# EAGLE design ESP_IAQ_baseBoard (EAGLE 9.6.2)
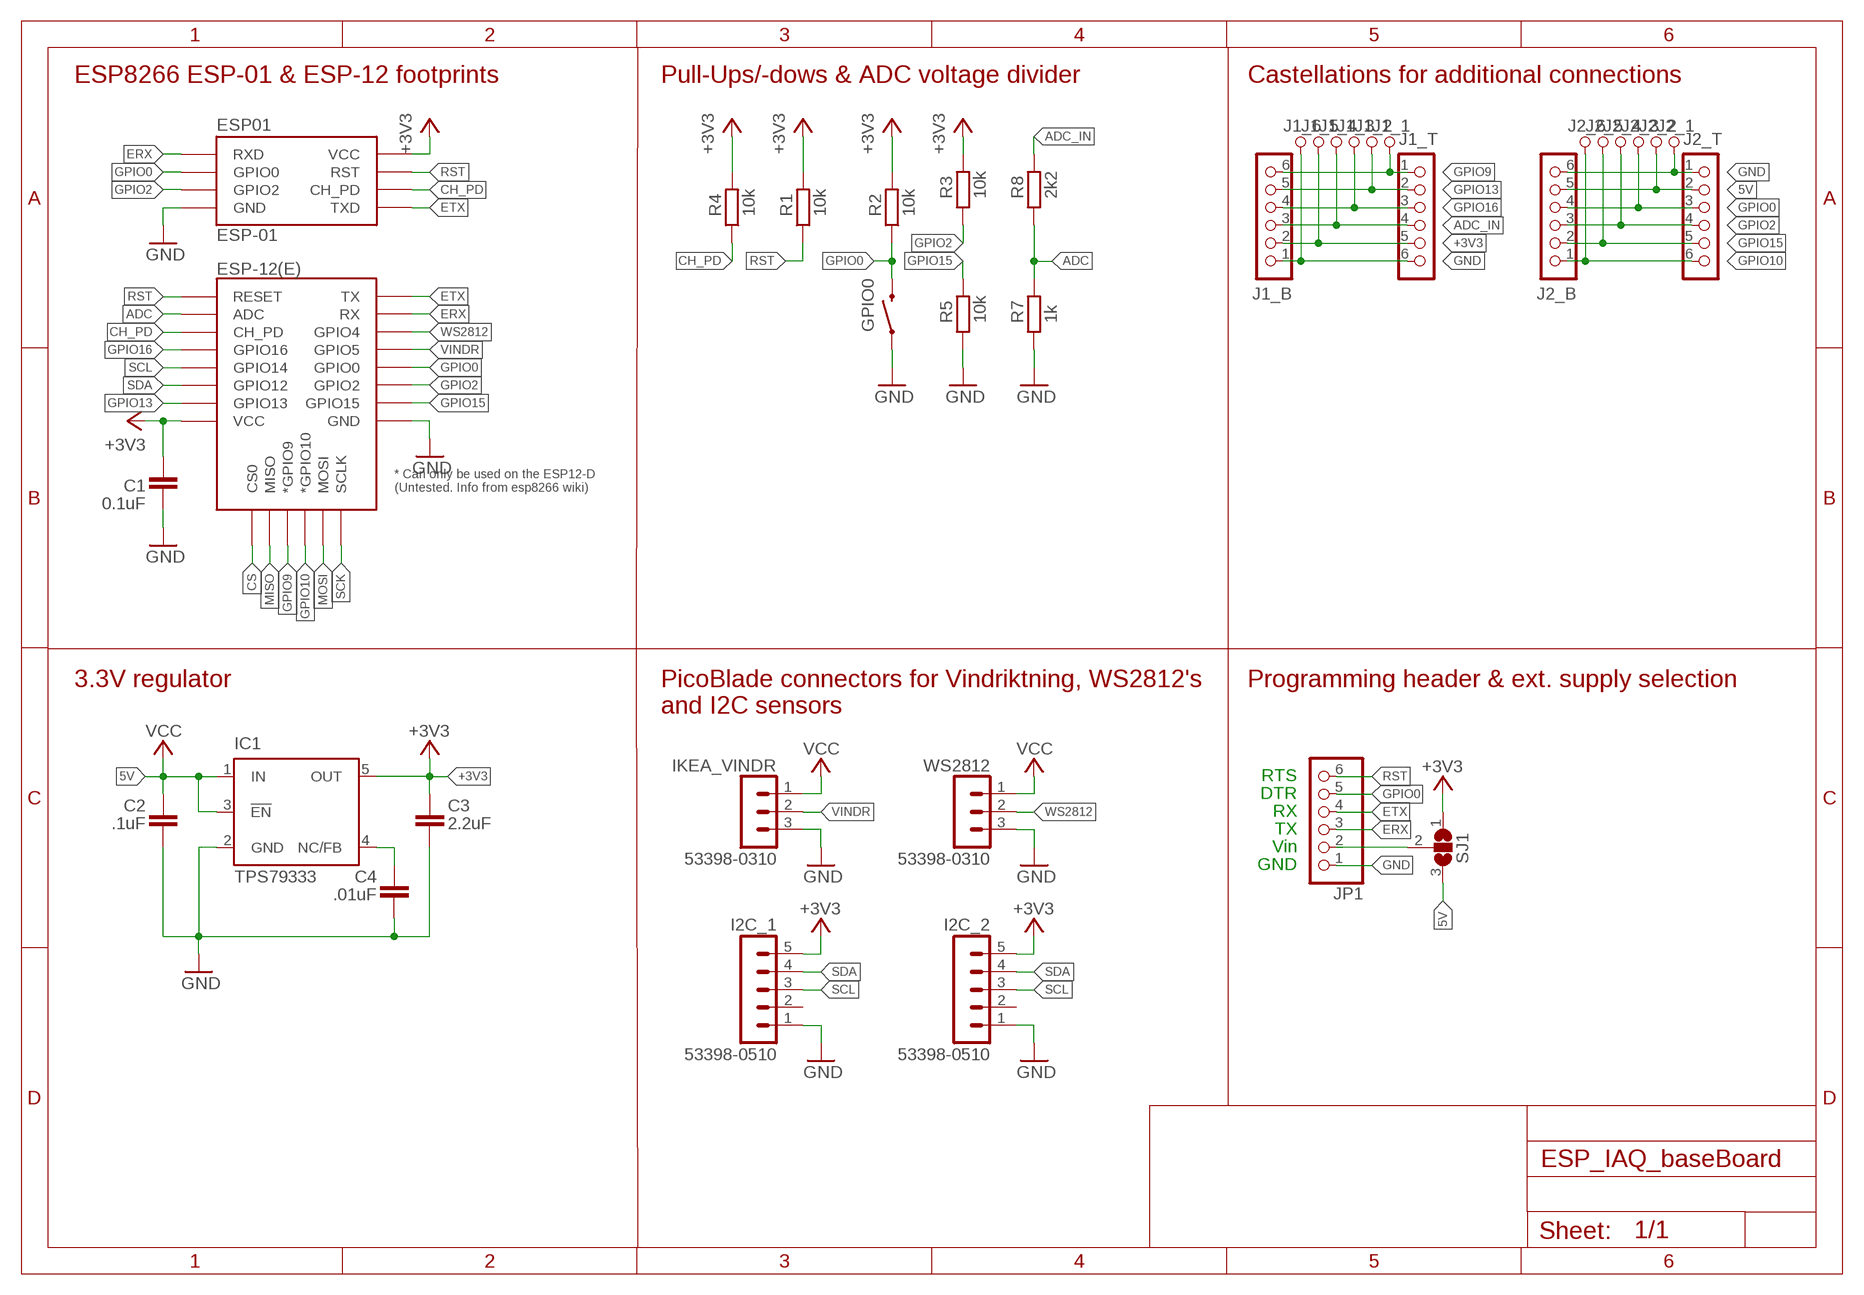
[diagram p0: schematic, sheet 1]

## Parts
C1  0.1uF  CAPACITOR_NPOL-0805  [C805]
C2  .1uF  CAPACITOR_NPOL-0805  [C805]
C3  2.2uF  CAPACITOR_NPOL-0805  [C805]
C4  .01uF  CAPACITOR_NPOL-0805  [C805]
ESP-01  ESP01  [ESP01]
ESP-12(E)  ESP12ESMD  [ESP12E-SMD]
GPIO0  MOMENTARY-SWITCH-SPST-SMD-RIGHT-ANGLE  [TACTILE_SWITCH_SMD_RIGHT_ANGLE]
I2C_1  53398-0510  [53398-0510]
I2C_2  53398-0510  [53398-0510]
IC1  TPS79333  TPS77033  [SOT23-DBV]
IKEA_VINDR  53398-0310  [53398-0310]
J1_1  PAD_TERMINAL-1.02MM_ROUND  [CON_PAD_ROUND_1.02MM]
J1_2  PAD_TERMINAL-1.02MM_ROUND  [CON_PAD_ROUND_1.02MM]
J1_3  PAD_TERMINAL-1.02MM_ROUND  [CON_PAD_ROUND_1.02MM]
J1_4  PAD_TERMINAL-1.02MM_ROUND  [CON_PAD_ROUND_1.02MM]
J1_5  PAD_TERMINAL-1.02MM_ROUND  [CON_PAD_ROUND_1.02MM]
J1_6  PAD_TERMINAL-1.02MM_ROUND  [CON_PAD_ROUND_1.02MM]
J1_B  CON_HEADER_1X06-SMD-RIGHT-ANGLED  [M1X6_MALE_RIGHT_ANGLED_SMD]
J1_T  CON_HEADER_1X06-SMD-RIGHT-ANGLED  [M1X6_MALE_RIGHT_ANGLED_SMD]
J2_1  PAD_TERMINAL-1.02MM_ROUND  [CON_PAD_ROUND_1.02MM]
J2_2  PAD_TERMINAL-1.02MM_ROUND  [CON_PAD_ROUND_1.02MM]
J2_3  PAD_TERMINAL-1.02MM_ROUND  [CON_PAD_ROUND_1.02MM]
J2_4  PAD_TERMINAL-1.02MM_ROUND  [CON_PAD_ROUND_1.02MM]
J2_5  PAD_TERMINAL-1.02MM_ROUND  [CON_PAD_ROUND_1.02MM]
J2_6  PAD_TERMINAL-1.02MM_ROUND  [CON_PAD_ROUND_1.02MM]
J2_B  CON_HEADER_1X06-SMD-RIGHT-ANGLED  [M1X6_MALE_RIGHT_ANGLED_SMD]
J2_T  CON_HEADER_1X06-SMD-RIGHT-ANGLED  [M1X6_MALE_RIGHT_ANGLED_SMD]
JP1  PINHD-1X6LOCK  [1X06-BIGLOCK]
R1  10k  RESISTOR-0603  [R603]
R2  10k  RESISTOR-0603  [R603]
R3  10k  RESISTOR-0603  [R603]
R4  10k  RESISTOR-0603  [R603]
R5  10k  RESISTOR-0603  [R603]
R7  1k  RESISTOR-0603  [R603]
R8  2k2  RESISTOR-0603  [R603]
SJ1  SJ2W  [SJ_2]
WS2812  53398-0310  [53398-0310]

## Nets
5V: C2.1 IC1.1(IN) IC1.3(!EN) IKEA_VINDR.1 J2_2.P J2_B.5 J2_T.2 SJ1.3 WS2812.1 ; supply symbol labelled VCC
+3V3: C1.1 C3.1 ESP-01.VCC ESP-12(E).VCC I2C_1.5 I2C_2.5 IC1.5(OUT) J1_5.P J1_B.2 J1_T.5 R1.2 R2.2 R3.2 R4.2 SJ1.1
ADC: ESP-12(E).ADC R7.2 R8.1
ADC_IN: J1_4.P J1_B.3 J1_T.4 R8.2
BYPASS: C4.1 IC1.4(NC/FB)
CH_PD: ESP-01.CH_PD ESP-12(E).CH_PD R4.1
CS: ESP-12(E).CS0
ERX: ESP-01.RX(RXD) ESP-12(E).RXD0(RX) JP1.3
ETX: ESP-01.TX(TXD) ESP-12(E).TXD0(TX) JP1.4
GND: C1.2 C2.2 C3.2 C4.2 ESP-01.GND ESP-12(E).GND GPIO0.1 I2C_1.1 I2C_2.1 IC1.2(GND) IKEA_VINDR.3 J1_6.P J1_B.1 J1_T.6 J2_1.P J2_B.6 J2_T.1 JP1.1 R5.1 R7.1 WS2812.3
GPIO0: ESP-01.GPIO0 ESP-12(E).GPIO0 GPIO0.2 J2_3.P J2_B.4 J2_T.3 JP1.5 R2.1
GPIO2: ESP-01.GPIO2 ESP-12(E).GPIO2 J2_4.P J2_B.3 J2_T.4 R3.1
GPIO9: ESP-12(E).GPIO9(*GPIO9) J1_1.P J1_B.6 J1_T.1
GPIO10: ESP-12(E).GPIO10(*GPIO10) J2_6.P J2_B.1 J2_T.6
GPIO13: ESP-12(E).GPIO13 J1_2.P J1_B.5 J1_T.2
GPIO15: ESP-12(E).GPIO15 J2_5.P J2_B.2 J2_T.5 R5.2
GPIO16: ESP-12(E).GPIO16 J1_3.P J1_B.4 J1_T.3
MISO: ESP-12(E).MISO
MOSI: ESP-12(E).MOSI
RST: ESP-01.RST ESP-12(E).RESET JP1.6 R1.1
SCK: ESP-12(E).SCLK
SCL: ESP-12(E).GPIO14 I2C_1.3 I2C_2.3
SDA: ESP-12(E).GPIO12 I2C_1.4 I2C_2.4
VIN: JP1.2 SJ1.2
VINDR: ESP-12(E).GPIO5 IKEA_VINDR.2
WS2812: ESP-12(E).GPIO4 WS2812.2
Unconnected: I2C_1.2 I2C_2.2

## Notes on the sheet
- ESP8266 ESP-01 & ESP-12 footprints | Pull-Ups/-dows & ADC voltage divider | Castellations for additional connections
- 3.3V regulator
- PicoBlade connectors for Vindriktning, WS2812's
  and I2C sensors
- Programming header & ext. supply selection
- RTS
- DTR
- RX
- TX
- Vin
- GND

## Library data of the parts
C1-C4 = dp_devices:CAPACITOR_NPOL: Non-Polarized capacitor in various packages
ESP-01 = esp8266modules:ESP01: ESP8266 Wifi module 01
ESP-12(E) = esp8266modules:ESP12E: ESP12E Module
GPIO0 = SparkFun-Switches:MOMENTARY-SWITCH-SPST: Momentary Switch (Pushbutton) - SPST Normally-open (NO) SPST momentary switches (buttons, pushbuttons). Variants PTH-12MM - 12mm square, through-hole Momentary Pushbutton Switch - 12mm Square <https://www.sparkfun.com/products/9190> (COM-09190) PTH-6.0MM, PTH-6.0MM-KIT - 6.0mm square, through-hole Mini Pushbutton Switch <https://www.sparkfun.com/products/97> (COM-00097) KIT package intended for soldering kit's - only one side of pads' copper is exposed. PTH-RIGHT-ANGLE-KIT - Right-angle, through-hole Right Angle Tactile Button <https://www.sparkfun.com/products/10791> - Used on SparkFun BigTime Watch Kit <https://www.sparkfun.com/products/11734> SMD-12MM - 12mm square, surface-mount Tactile Button - SMD (12mm) <https://www.sparkfun.com/products/12993> (COM-12993) Used on SparkFun PicoBoard <https://www.sparkfun.com/products/11888> SMD-4.5MM - 4.5mm Square Trackball Switch Used on SparkFun Blackberry Trackballer Breakout <https://www.sparkfun.com/products/13169> SMD-4.6MMX2.8MM - 4.60mm x 2.80mm, surface mount Used on SparkFun SAMD21 Mini Breakout <https://www.sparkfun.com/products/13664> SMD-5.2MM, SMD-5.2-REDUNDANT - 5.2mm square, surface-mount Mini Pushbutton Switch - SMD <https://www.sparkfun.com/products/8720> (COM-08720) Used on Arduino Pro Mini <https://www.sparkfun.com/products/11114> REDUNDANT package connects both switch circuits together SMD-6.0X3.5MM - 6.0 x 3.5mm, surface mount Momentary Reset Switch SMD <https://www.sparkfun.com/products/8229> (COM-08229) SMD-6.2MM-TALL - 6.2mm square, surface mount Tactile Button - SMD (6mm) <https://www.sparkfun.com/products/12992> Used on SparkFun Digital Sandbox <https://www.sparkfun.com/products/12651> SMD-RIGHT-ANGLE - Right-angle, surface mount Used on SparkFun Block for Intel® Edison - Arduino <https://www.sparkfun.com/products/13036>; PROD_ID: COMP-12265
I2C_1 I2C_2 = con-molex-picoblade:53398-0510: HEADER
IC1 = texas:TPS770*: ULTRALOW-POWER 50-mA LOW-DROPOUT LINEAR REGULATORS 50-mA Low-Dropout Regulator Source: http://focus.ti.com/lit/ds/symlink/tps77001.pdf; MF: TEXAS INSTRUMENTS; MPN: TPS77033DBVT; OC_FARNELL: 8461570; OC_NEWARK: 77C1187
IKEA_VINDR WS2812 = con-molex-picoblade:53398-0310: HEADER
J1_1-J1_6 J2_1-J2_6 = dp_devices:PAD_TERMINAL: Terminal connection pad
J1_B J1_T J2_B J2_T = dp_devices:CON_HEADER_1X06
JP1 = adafruit:PINHD-1X6: PIN HEADER
R1-R5 R7 R8 = dp_devices:RESISTOR
SJ1 = jumper:SJ2W: SMD solder JUMPER

## Board
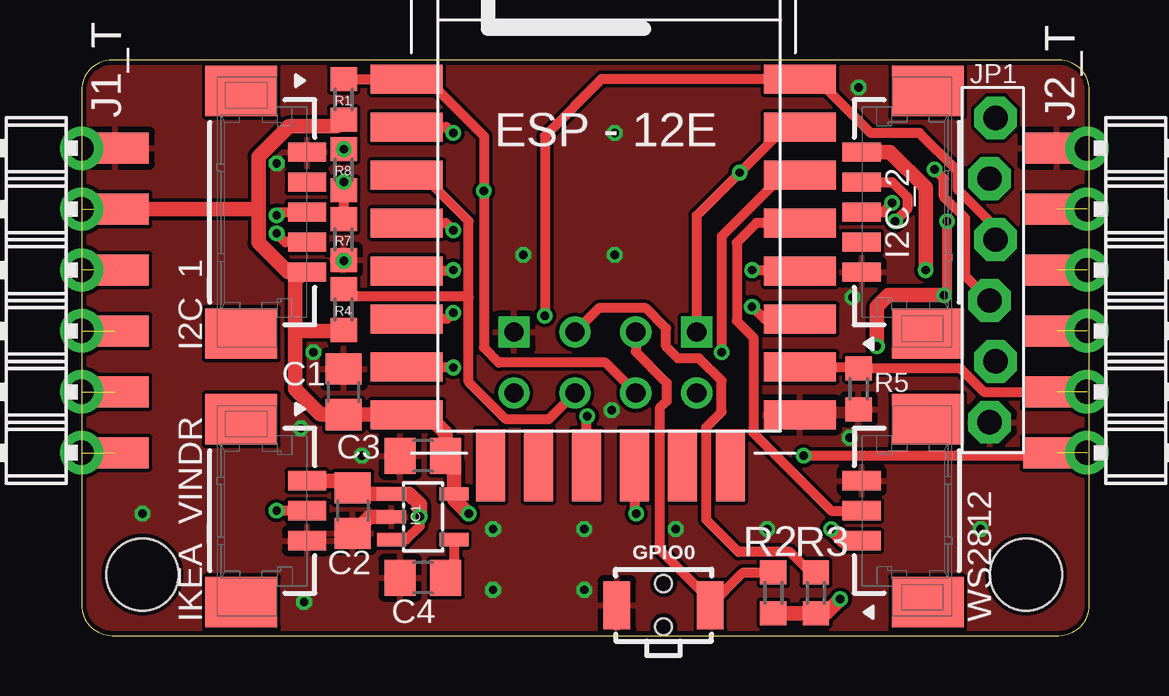
[diagram p1: board, top side]
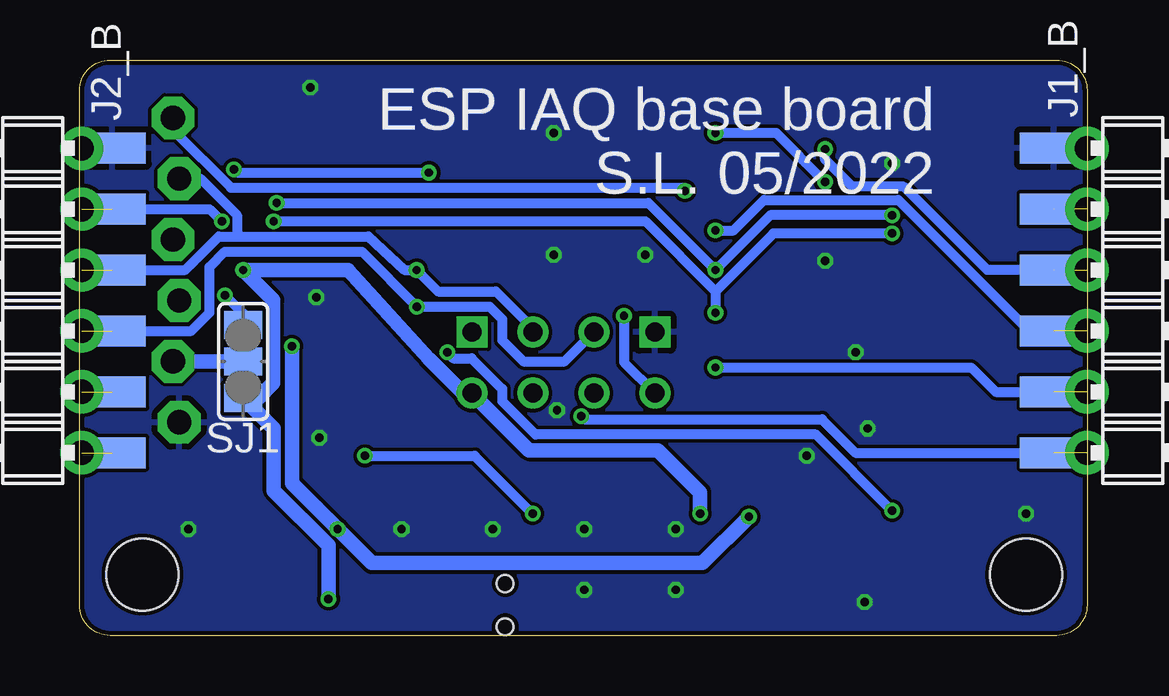
[diagram p2: board, bottom side, seen from below]

Size 42 x 24 mm. Coordinates in mm from the lower left corner, seen from the top.
Outline: 0,22.73 0,1.27 arc90 1.27,0 40.73,0 arc90 42,1.27 42,22.73 arc90 40.73,24 1.27,24 arc90 0,22.73
Copper layers (1*16): Top 0.035mm / dielectric 1.5mm / Bottom 0.035mm
Design rules "aisler_2_layer": minimum track width 0.1mm, minimum drill 0.2mm, track to track 0.15mm, track to pad 0.15mm, pad to pad 0.1mm, via to via 0.1mm, smd to smd 0.1mm, copper to edge 0.2mm, drill to drill 0.21mm, minimum pad ring 0.25mm, minimum via ring 0.15mm, stop-mask expansion 0mil, vias tented up to drill 0mil, thermal gap 10mil
Holes 3 mm at 2.54,2.54 39.37,2.54

### Footprints (pad centres in the part's own frame; a part is rotated, then mirrored left to right if it is on the bottom)
C805 = smd 1.3 x 1.5: 1 -0.95,0; 2 0.95,0
ESP01 = drill 0.8: CH_PD -1.285,-8.178; GPIO0 1.255,-5.638; GPIO2 -1.285,-5.638; RST 1.255,-8.178; TX -3.825,-8.178; VCC 3.795,-8.178 | drill 0.8 square: GND -3.825,-5.638; RX 3.795,-5.638
ESP12E-SMD = smd 3 x 1.2: ADC -8.3,3.8; CH_PD -8.3,1.8; GND 8.1,-8.2; GPIO0 8.1,-2.2; GPIO2 8.1,-4.2; GPIO4 8.1,-0.2; GPIO5 8.1,1.8; GPIO12 -8.3,-4.2; GPIO13 -8.3,-6.2; GPIO14 -8.3,-2.2; GPIO15 8.1,-6.2; GPIO16 -8.3,-0.2; RESET -8.3,5.8; RXD0 8.1,3.8; TXD0 8.1,5.8; VCC -8.3,-8.2 | smd 1.2 x 3: CS0 -4.8,-10.3; GPIO9 -0.8,-10.3; GPIO10 1.2,-10.3; MISO -2.8,-10.3; MOSI 3.2,-10.3; SCLK 5.2,-10.3
TACTILE_SWITCH_SMD_RIGHT_ANGLE = smd 1.1 x 2: 1 -1.95,0; 2 1.95,0 | hole 0.7: 0,0.9; 0,-0.9
53398-0510 = smd 0.8 x 1.6: 1 2.5,0; 2 1.25,0; 3 0,0; 4 -1.25,0; 5 -2.5,0 | smd 2.1 x 3: M1 5.06,2.75; M2 -5.06,2.75
SOT23-DBV = smd 0.55 x 1.2: 1 -0.95,-1.3; 2 0,-1.3; 3 0.95,-1.3; 4 0.95,1.3; 5 -0.95,1.3
53398-0310 = smd 0.8 x 1.6: 1 1.25,0; 2 0,0; 3 -1.25,0 | smd 2.1 x 3: M1 3.81,2.75; M2 -3.81,2.75
CON_PAD_ROUND_1.02MM = drill 1.02 pad 1.81: P 0,0
M1X6_MALE_RIGHT_ANGLED_SMD = smd 1.3 x 2.8: 1 -6.35,-3.3; 2 -3.81,-3.3; 3 -1.27,-3.3; 4 1.27,-3.3; 5 3.81,-3.3; 6 6.35,-3.3
1X06-BIGLOCK = drill 1.016 pad 1.778 octagon: 1 -6.35,0.127; 2 -3.81,-0.127; 3 -1.27,0.127; 4 1.27,-0.127; 5 3.81,0.127; 6 6.35,-0.127
R603 = smd 1 x 1.1: 1 -0.85,0; 2 0.85,0
SJ_2 = smd 1.168 x 1.6: 1 -1.524,0; 2 0,0; 3 1.524,0

### Placement (x,y rotation side)
C1  10.92,10.16 90 top
C2  11.3,5.21 270 top
C3  14.22,7.49 180 top
C4  14.22,2.41 180 top
ESP-01  21.84,18.29 0 top
ESP-12(E)  21.84,17.4 0 top
GPIO0  24.26,1.27 0 top
I2C_1  9.4,17.65 90 top
I2C_2  32.51,17.65 270 top
IC1  14.22,4.95 270 top
IKEA_VINDR  9.4,5.21 90 top
J1_1  0,7.62 0 top
J1_2  0,10.16 0 top
J1_3  0,12.7 0 top
J1_4  0,15.24 0 top
J1_5  0,17.78 0 top
J1_6  0,20.32 0 top
J1_B  -1.91,13.97 270 bottom
J1_T  -1.91,13.97 90 top
J2_1  41.91,20.32 0 top
J2_2  41.91,17.78 0 top
J2_3  41.91,15.24 0 top
J2_4  41.91,12.7 0 top
J2_5  41.91,10.16 0 top
J2_6  41.91,7.62 0 top
J2_B  43.94,13.97 90 bottom
J2_T  43.94,13.97 270 top
JP1  37.97,15.24 90 top
R1  10.92,22.35 270 top
R2  28.83,1.78 270 top
R3  30.61,1.78 270 top
R4  10.92,13.59 270 top
R5  32.38,10.29 90 top
R7  10.92,16.51 90 top
R8  10.92,19.43 90 top
SJ1  35.18,11.43 90 bottom
WS2812  32.51,5.21 270 top

### Tracks (layer width: path | path; a pad name or v marks a point on that pad's centre or on a via)
5V  (via drill 0.35, 0.35 pad 0.65)  (2 unrouted)
  Top 0.406: v36.07,17.27 36.07,14.45 35.94,14.32 v35.94,14.2 | IC1.3 13.53,4 14.1,4.57 v14.1,4.95
  Top 0.61: v35.94,14.2 33.63,14.2 33.15,13.72 33.15,12.96 33.15,12.95 v33.15,12.06 | WS2812.1 31.75,3.96 31.26,4.45 v31.24,4.45 | IKEA_VINDR.1 11,6.46 C2.1 11.56,5.9 IC1.1 13.65,5.9 14.1,5.46 v14.1,4.95
  Bottom 0.406: 40.61,17.75 J2_B.5 36.58,17.78 v36.07,17.27 | SJ1.3 35.18,13.43 v35.94,14.2
  Bottom 0.61: v33.15,12.06 33.15,6.35 v31.24,4.45 29.82,3.02 16.02,3.02 v14.1,4.95
+3V3  (via drill 0.35, 0.35 pad 0.65)  (2 unrouted)
  Top 0.406: 10.91,21.52 R1.2
  Top 0.61: I2C_2.5 33.7,20.15 35.18,18.67 v35.18,15.24 | R1.2 10.66,21.24 8.64,21.24 7.37,19.96 7.37,17.78 | 7.37,17.78 7.37,16.38 8.6,15.15 I2C_1.5 9.27,15.15 8.89,14.77 8.89,12.7 | 7.37,17.78 J1_T.5 0.51,17.78 | 8.89,12.7 8.89,10.29 9.97,9.21 C1.1 ESP-12(E).VCC 14.42,9.2 15.17,8.45 C3.1 15.52,7.14 IC1.5 15.52,5.68 v16.13,5.08 | R4.2 10.88,12.7 8.89,12.7 | R2.2 R3.2 31.03,0.93 v31.62,1.52
  Bottom 0.61: v31.62,1.52 31.62,3.75 33.91,6.04 33.91,8.63 SJ1.1 34.54,9.91 33.92,10.53 33.92,13.98 v35.18,15.24 30.8,15.24 27.43,11.52 26.02,10.11 ESP-01.VCC 23.26,7.72 17.88,7.72 16.13,5.97 v16.13,5.08
ADC  (via drill 0.35)
  Top 0.406: R7.2 R8.1 v10.92,18.92 | v15.49,20.95 15.44,20.95 15.2,21.2 ESP-12(E).ADC
  Bottom 0.406: v10.92,18.92 12.96,20.95 v15.49,20.95
ADC_IN  (via drill 0.35)  (2 unrouted)
  Top 0.61: J1_B.3 0.51,15.24
  Bottom 0.406: R8.2 10.92,19.86 9.78,18.72 7.64,18.72 4.17,15.24 J1_B.3
  other vias: 10.92,20.28
BYPASS
  Top 0.406: IC1.4 15.52,2.76 C4.1
CH_PD
  Top 0.406: R4.1 11.21,14.15 16.07,14.15 16.13,14.1 | 16.13,14.1 16.13,17.27 14.2,19.2 ESP-12(E).CH_PD | ESP-01.CH_PD 19.46,9.02 17.69,9.02 16.13,10.58 16.13,14.1
ERX  (via drill 0.35)
  Top 0.406: JP1.3 36.83,14.99 36.83,17.4 35.94,18.29 35.94,19.05 v35.56,19.43 | ESP-12(E).RXD0 29.33,21.2 v27.43,19.3 25.64,17.51 ESP-01.RX
  Bottom 0.406: v35.56,19.43 35.43,19.3 v27.43,19.3
ETX  (via drill 0.35)
  Top 0.406: JP1.4 38.1,17.02 36.52,18.59 36.52,19.36 34.92,20.95 32.89,20.95 30.65,23.2 ESP-12(E).TXD0 21.68,23.2 19.3,20.83 v19.3,13.34
  Bottom 0.406: v19.3,13.34 19.3,11.4 ESP-01.TX
GND  (via drill 0.35)
  Top 0.61: IC1.2 12,4.95 C2.2
  other vias: 32.13,14.1 8.13,19.68 9.65,11.81 10.92,15.62 17.14,4.45 9.27,1.4 2.54,5.08 20.95,4.45 20.95,1.91 28.57,4.45 32,8.26 22.23,15.88 22.23,20.95 32.38,22.86 37.47,4.45 18.41,15.88 24.77,4.45 11.68,7.49 9.14,8.64 17.14,1.91 22.1,9.4
  pour Top: 0,0 0,24.13 41.91,24.13 41.91,0
  pour Bottom: 0,0 0,24.13 41.91,24.13 41.91,0
GPIO0  (via drill 0.35)  (2 unrouted)
  Top 0.406: v27.95,15.24 29.9,15.24 ESP-12(E).GPIO0 | ESP-01.GPIO0 23.1,11.83 24.38,10.54 24.38,9.78 24.09,9.49 24.09,3.6 26.21,1.48 GPIO0.2 27.57,2.63 R2.1
  Bottom 0.406: J2_T.3 37.59,15.24 36.2,16.64 35.43,16.64 | 35.43,16.64 29.97,16.64 28.47,15.24 v27.95,15.24 27.06,14.35 24.64,14.35 23.1,12.81 ESP-01.GPIO0 | JP1.5 36.96,19.05 35.43,17.53 35.43,16.64
GPIO2  (via drill 0.35)  (2 unrouted)
  Top 0.406: 29.25,13.2 ESP-12(E).GPIO2 28.46,13.2 v27.94,13.72 | R3.1 30.38,2.63 29.52,3.48 27.38,3.48 26.04,4.83 26.04,8.69 26.67,9.32 26.67,10.62 25.74,11.56 24.86,11.56 24.36,12.06 24.36,12.81 23.52,13.65 21.56,13.65 ESP-01.GPIO2
  Bottom 0.406: J2_B.3 37.34,12.7 36.7,13.34 36.58,13.46 36.58,15.37 35.94,16 30.23,16 v27.94,13.72 24.91,13.72 24.38,13.2 24.38,12.32 23.5,11.43 21.78,11.43 ESP-01.GPIO2
GPIO9  (via drill 0.35)  (2 unrouted)
  Top 0.406: ESP-12(E).GPIO9 21.04,9.11 v21.08,9.14
  Bottom 0.406: v21.08,9.14 20.95,9.02 11.05,9.02 9.65,7.62 J1_T.1
GPIO10  (via drill 0.35)  (2 unrouted)
  Top 0.406: ESP-12(E).GPIO10 23.04,5.15 v23.11,5.08 | J2_B.1 40.52,7.49 v30.1,7.49
  Bottom 0.406: v30.1,7.49 25.53,7.49 v23.11,5.08
GPIO13  (via drill 0.35)  (2 unrouted)
  Top 0.406: ESP-12(E).GPIO13 15.47,11.2 v15.49,11.18
  Bottom 0.406: v15.49,11.18 4.83,11.18 3.81,10.16 J1_B.5
GPIO15  (2 unrouted)
  Top 0.406: ESP-12(E).GPIO15 32.32,11.2 R5.2 36.64,11.14 37.61,10.16 J2_T.5
GPIO16  (via drill 0.35)  (2 unrouted)
  Top 0.406: ESP-12(E).GPIO16 15.19,17.2 v15.49,16.89
  Bottom 0.406: v15.49,16.89 14.73,16.89 13.46,18.16 7.87,18.16 2.41,12.7 J1_T.3
RST  (via drill 0.35)
  Top 0.406: R1.1 ESP-12(E).RESET 14.39,23.2 16.76,20.83 v16.76,18.54 16.76,12 17.38,11.38 21.83,11.38 ESP-01.RST
  Bottom 0.406: JP1.6 38.1,21.08 35.69,18.67 16.89,18.67 v16.76,18.54
SCL  (via drill 0.35)
  Top 0.406: v15.49,15.24 15.45,15.2 ESP-12(E).GPIO14 | I2C_2.3 33.4,17.65 v33.78,18.03 | v8.13,17.53 8.26,17.65 I2C_1.3
  Bottom 0.406: v8.13,17.53 13.21,17.53 v15.49,15.24 18.29,18.03 v33.78,18.03
SDA  (via drill 0.35)
  Top 0.406: I2C_1.4 8.49,16.4 v8.13,16.76 | v15.49,13.46 15.23,13.2 ESP-12(E).GPIO12 | I2C_2.4 33.8,18.9 34.42,18.29 34.42,17.78 v33.91,17.27
  Bottom 0.406: v8.13,16.76 13.08,16.76 15.49,14.35 | 15.49,14.35 v15.49,13.46 | 15.49,14.35 18.41,17.27 v33.91,17.27
VIN
  Bottom 0.61: SJ1.2 JP1.2
VINDR  (via drill 0.35)
  Top 0.406: IKEA_VINDR.2 v8.13,5.21 | v26.67,11.81 26.67,16.64 29.23,19.2 ESP-12(E).GPIO5
  Bottom 0.406: v8.13,5.21 11.3,8.38 22.99,8.38 24.38,9.78 24.38,10.29 25.65,11.56 26.42,11.56 v26.67,11.81
WS2812
  Top 0.406: ESP-12(E).GPIO4 28.12,17.2 27.3,16.38 27.3,13.12 28,12.43 28,8.45 31.24,5.21 WS2812.2

### Text on the board
bNames: ESP IAQ base board / S.L. 05/2022
Reference: GND / 3V3 / ADC / GPIO16 / GPIO13 / GPIO9 | GND / 5V / GPIO0 / GPIO2 / GPIO15 / GPIO10